# EAGLE design Button (EAGLE 6.2)
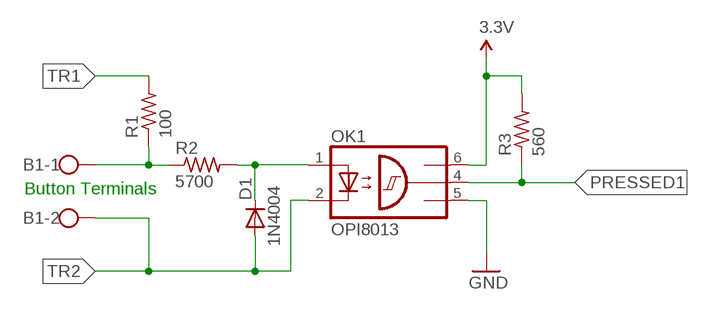
[diagram p0: schematic, sheet 1]

## Parts
B1  W237-102  [W237-102]
D1  1N4004  [DO41-10]
OK1  OPI8013  [DIL06]
R1  100  R-US_0817/22  [P0817/22]
R2  5700  R-US_0207/12  [0207/12]
R3  560  R-US_0207/7  [0207/7]

## Nets
3.3V: OK1.6(VCC) R3.2
B1: B1.1 R1.1 R2.1
GND: OK1.5(GND)
N$6: D1.C OK1.1(A) R2.2
PRESSED1: OK1.4(OUT) R3.1
TR1: R1.2
TR2: B1.2 D1.A OK1.2(C)

## Notes on the sheet
- Button Terminals

## Library data of the parts
B1 = con-wago-500:W237-102: WAGO SCREW CLAMP; MPN: 237-102; OC_FARNELL: unknown; OC_NEWARK: 70K9898
D1 = adafruit:1N4004: DIODE General purpose 1N400x type rectifier (With bigger pads) http://www.ladyada.net/library/pcb/eaglelibrary.html
OK1 = optocoupler:OPI8013: OPTO COUPLER; OC_FARNELL: unknown; OC_NEWARK: unknown
R1-R3 = adafruit:R-US_: RESISTOR, American symbol

## Board
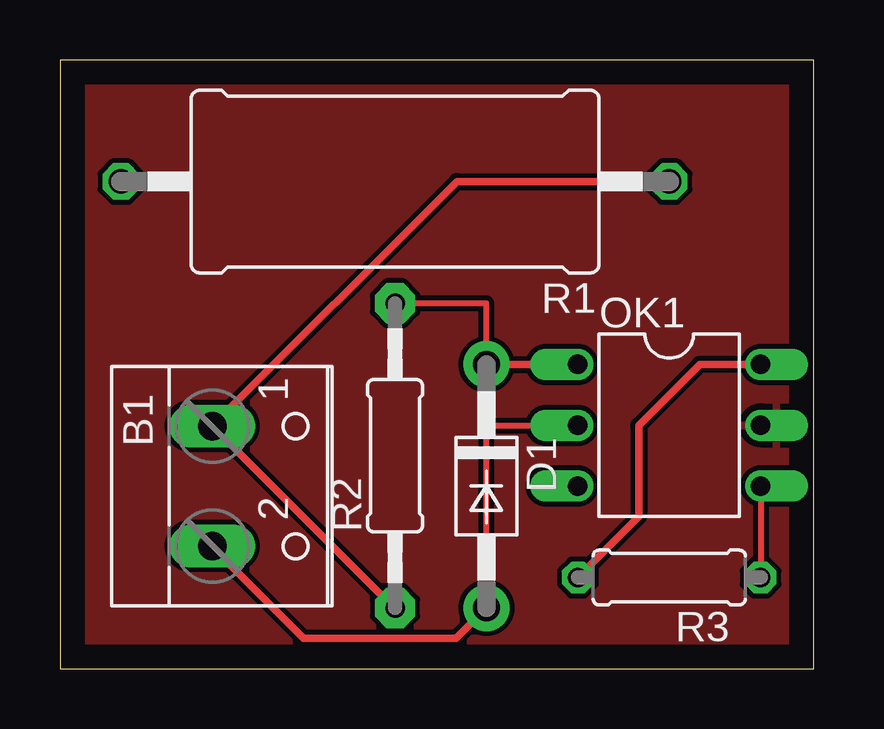
[diagram p1: board, top side]
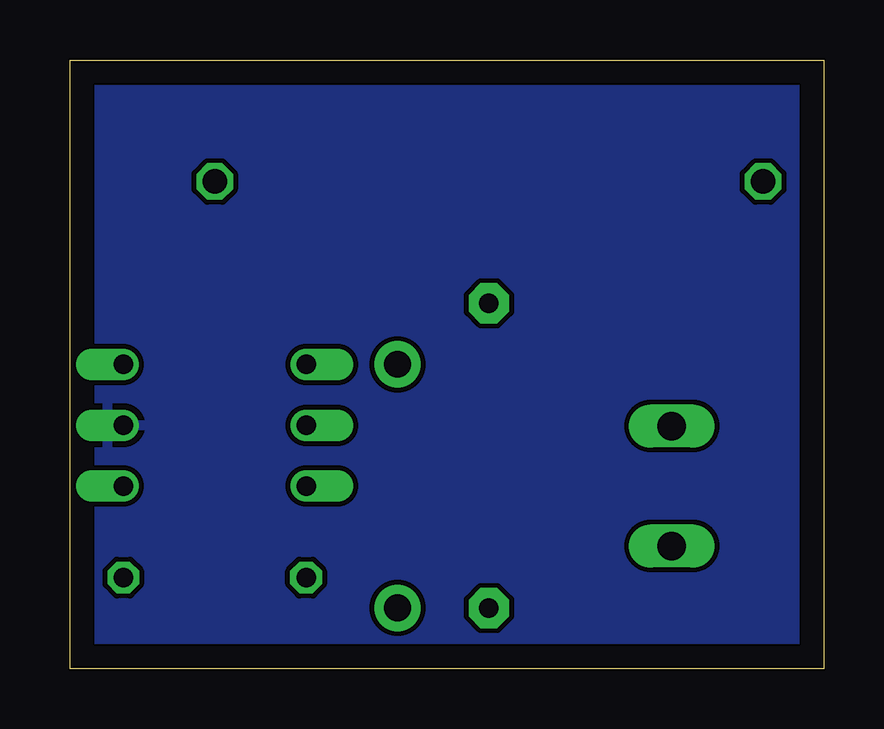
[diagram p2: board, bottom side, seen from below]

Size 31.42 x 25.39 mm. Coordinates in mm from the lower left corner, seen from the top.
Outline: 0,0 31.42,0 31.42,25.39 0,25.39 0,0
Copper layers (1*16): Top 0.035mm / dielectric 1.5mm / Bottom 0.035mm
Design rules: minimum track width 10mil, minimum drill 24mil, track to track 8mil, track to pad 8mil, pad to pad 8mil, via to via 8mil, smd to smd 8mil, copper to edge 40mil, drill to drill 8mil, minimum pad ring 10mil, minimum via ring 8mil, stop-mask expansion 4mil, vias tented up to drill 0mil, thermal gap 10mil

### Footprints (pad centres in the part's own frame; a part is rotated, then mirrored left to right if it is on the bottom)
W237-102 = drill 1.194 long: 1 -2.5,-1.27; 2 2.5,-1.27
DO41-10 = drill 1.118 pad 1.93: A 5.08,0; C -5.08,0
DIL06 = drill 0.813 offset: 1 -2.54,-3.81; 2 0,-3.81; 3 2.54,-3.81; 4 2.54,3.81; 5 0,3.81; 6 -2.54,3.81
P0817/22 = drill 1.016 octagon: 1 -11.43,0; 2 11.43,0
0207/12 = drill 0.813 pad 1.676 octagon: 1 -6.35,0; 2 6.35,0
0207/7 = drill 0.813 octagon: 1 -3.81,0; 2 3.81,0

### Placement (x,y rotation side)
B1  7.62,7.62 270 top
D1  17.78,7.62 270 top
OK1  25.4,10.16 270 top
R1  13.97,20.32 180 top
R2  13.97,8.89 90 top
R3  25.4,3.81 180 top

### Tracks (layer width: path | path; a pad name or v marks a point on that pad's centre or on a via)
3.3V
  Top 0.305: OK1.6 26.67,12.7 24.13,10.16 24.13,6.35 R3.2
B1
  Top 0.305: R1.1 16.55,20.32 B1.1 13.93,2.54 R2.1
GND
  pour Bottom: -1.27,26.67 40.64,26.67 40.64,-1.27 -1.27,-1.27
  pour Top: -1.27,26.67 33.02,26.67 33.02,-1.27 -1.27,-1.27
N$6
  Top 0.254: R2.2 17.78,15.24 D1.C
  Top 0.305: D1.C OK1.1
PRESSED1
  Top 0.254: OK1.4 R3.1
TR2
  Top 0.254: OK1.2 17.78,10.16 D1.A
  Top 0.305: D1.A 16.51,1.27 10.16,1.27 6.35,5.08 B1.2